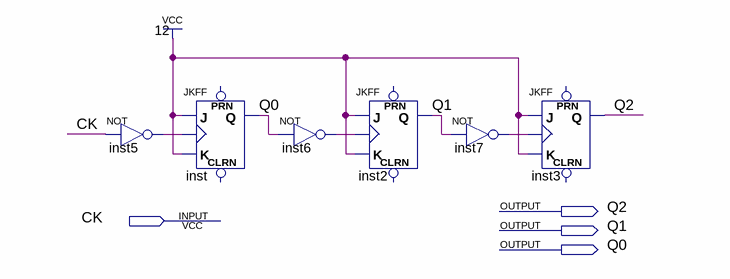
[diagram p0: schematic sheet]
// Quartus schematic 8_MOD_A_U.bdf as structural Verilog: 6 symbols, 4 pins
module \8_MOD_A_U  (
  input  CK,
  output Q2,
  output Q1,
  output Q0
);

  wire inst5_out, inst6_out, inst7_out;

  not inst5 (inst5_out, CK);
  JKFF inst (.K(1'b1), .J(1'b1), .CLK(inst5_out), .Q(Q0));  // open: PRN, CLRN
  not inst6 (inst6_out, Q0);
  JKFF inst2 (.K(1'b1), .J(1'b1), .CLK(inst6_out), .Q(Q1));  // open: PRN, CLRN
  not inst7 (inst7_out, Q1);
  JKFF inst3 (.K(1'b1), .J(1'b1), .CLK(inst7_out), .Q(Q2));  // open: PRN, CLRN
endmodule
